# Altium schematic sheet headers.SchDoc: Headers
size A
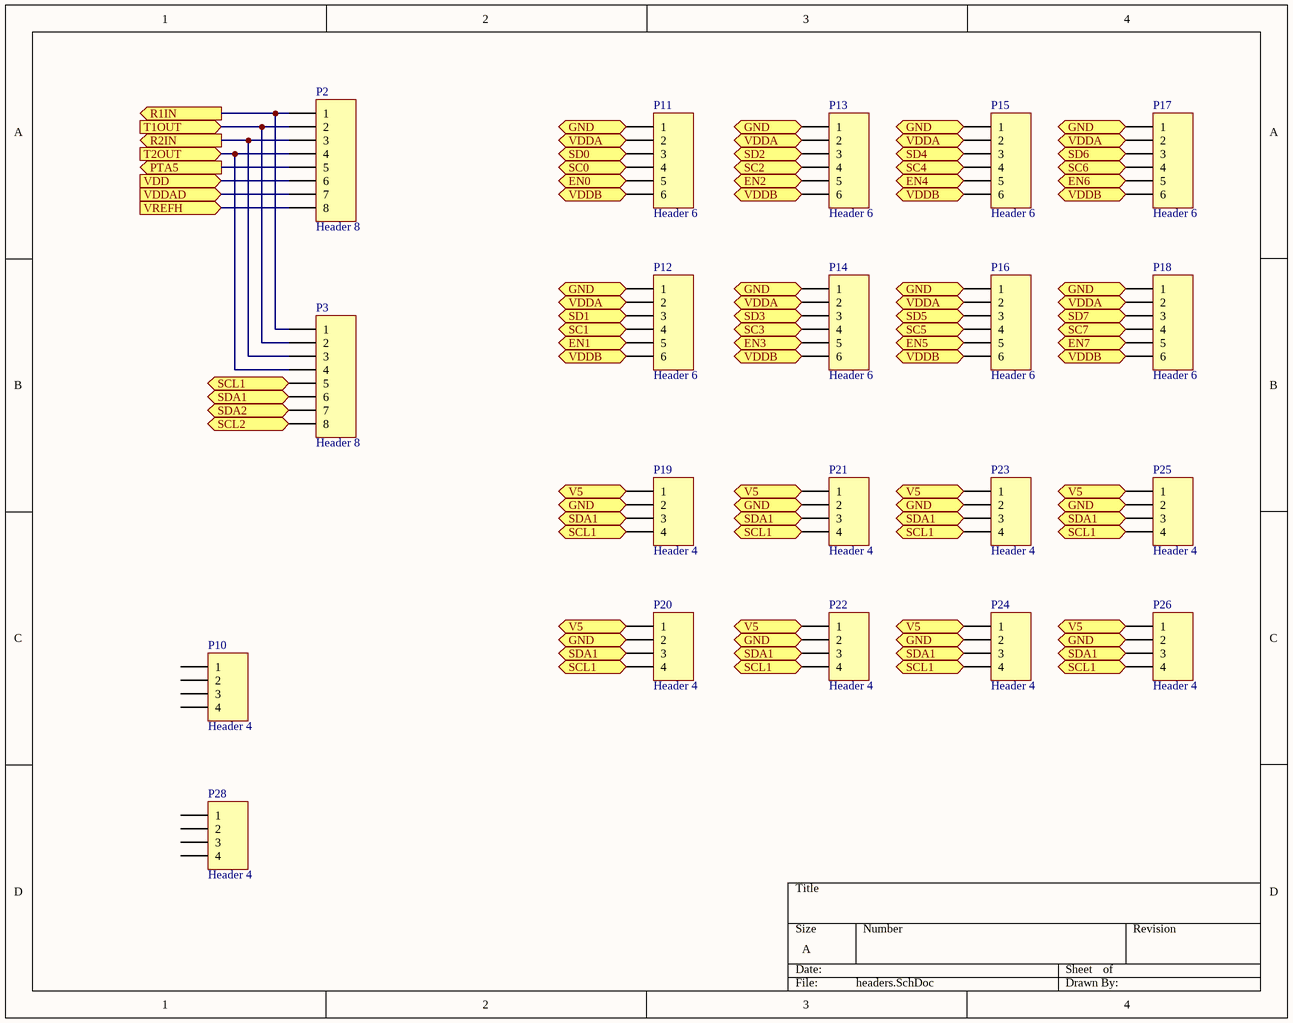
[diagram p0: headers.SchDoc]

## Parts
P2  Header 8  [HDR1X8]
P3  Header 8  [HDR1X8]
P10  Header 4  [HDR1X4]
P11  Header 6  [HDR1X6]
P12  Header 6  [HDR1X6]
P13  Header 6  [HDR1X6]
P14  Header 6  [HDR1X6]
P15  Header 6  [HDR1X6]
P16  Header 6  [HDR1X6]
P17  Header 6  [HDR1X6]
P18  Header 6  [HDR1X6]
P19  Header 4  [HDR1X4]
P20  Header 4  [HDR1X4]
P21  Header 4  [HDR1X4]
P22  Header 4  [HDR1X4]
P23  Header 4  [HDR1X4]
P24  Header 4  [HDR1X4]
P25  Header 4  [HDR1X4]
P26  Header 4  [HDR1X4]
P28  Header 4  [HDR1X4]

## Ports
EN0 (out), EN1 (out), EN2 (out), EN3 (out), EN4 (out), EN5 (out), EN6 (out), EN7 (out), GND (in), GND (out), PTA5 (out), R1IN (out), R2IN (out), SC0 (bidir), SC1 (bidir), SC2 (bidir), SC3 (bidir), SC4 (bidir), SC5 (bidir), SC6 (bidir), SC7 (bidir), SCL1 (in), SCL2 (in), SD0 (bidir), SD1 (bidir), SD2 (bidir), SD3 (bidir), SD4 (bidir), SD5 (bidir), SD6 (bidir), SD7 (bidir), SDA1 (in), SDA2 (in), T1OUT (in), T2OUT (in), V5 (in), VDD (in), VDDA (out), VDDAD (in), VDDB (out), VREFH (in)

## Nets
EN0: P11.5 ; port EN0
EN1: P12.5 ; port EN1
EN2: P13.5 ; port EN2
EN3: P14.5 ; port EN3
EN4: P15.5 ; port EN4
EN5: P16.5 ; port EN5
EN6: P17.5 ; port EN6
EN7: P18.5 ; port EN7
GND: P11.1 P12.1 P13.1 P14.1 P15.1 P16.1 P17.1 P18.1 P19.2 P20.2 P21.2 P22.2 P23.2 P24.2 P25.2 P26.2 ; port GND
PTA5: P2.5 ; port PTA5
R1IN: P2.1 P3.1 ; port R1IN
R2IN: P2.3 P3.3 ; port R2IN
SC0: P11.4 ; port SC0
SC1: P12.4 ; port SC1
SC2: P13.4 ; port SC2
SC3: P14.4 ; port SC3
SC4: P15.4 ; port SC4
SC5: P16.4 ; port SC5
SC6: P17.4 ; port SC6
SC7: P18.4 ; port SC7
SCL1: P3.5 P19.4 P20.4 P21.4 P22.4 P23.4 P24.4 P25.4 P26.4 ; port SCL1
SCL2: P3.8 ; port SCL2
SD0: P11.3 ; port SD0
SD1: P12.3 ; port SD1
SD2: P13.3 ; port SD2
SD3: P14.3 ; port SD3
SD4: P15.3 ; port SD4
SD5: P16.3 ; port SD5
SD6: P17.3 ; port SD6
SD7: P18.3 ; port SD7
SDA1: P3.6 P19.3 P20.3 P21.3 P22.3 P23.3 P24.3 P25.3 P26.3 ; port SDA1
SDA2: P3.7 ; port SDA2
T1OUT: P2.2 P3.2 ; port T1OUT
T2OUT: P2.4 P3.4 ; port T2OUT
V5: P19.1 P20.1 P21.1 P22.1 P23.1 P24.1 P25.1 P26.1 ; port V5
VDD: P2.6 ; port VDD
VDDA: P11.2 P12.2 P13.2 P14.2 P15.2 P16.2 P17.2 P18.2 ; port VDDA
VDDAD: P2.7 ; port VDDAD
VDDB: P11.6 P12.6 P13.6 P14.6 P15.6 P16.6 P17.6 P18.6 ; port VDDB
VREFH: P2.8 ; port VREFH

Not connected (* = marked no-connect by the designer): P10 1 2 3 4; P28 1 2 3 4

## Library data of the parts
P2 P3 = Header 8: Header, 8-Pin; LatestRevisionDate: 17-Jul-2002; LatestRevisionNote: Re-released for DXP Platform.; Publisher: Altium Limited
P10 P19-P26 P28 = Header 4: Header, 4-Pin; LatestRevisionDate: 17-Jul-2002; LatestRevisionNote: Re-released for DXP Platform.; Publisher: Altium Limited
P11-P18 = Header 6: Header, 6-Pin; LatestRevisionDate: 17-Jul-2002; LatestRevisionNote: Re-released for DXP Platform.; Publisher: Altium Limited